# EAGLE design Receiver (EAGLE 5.00)
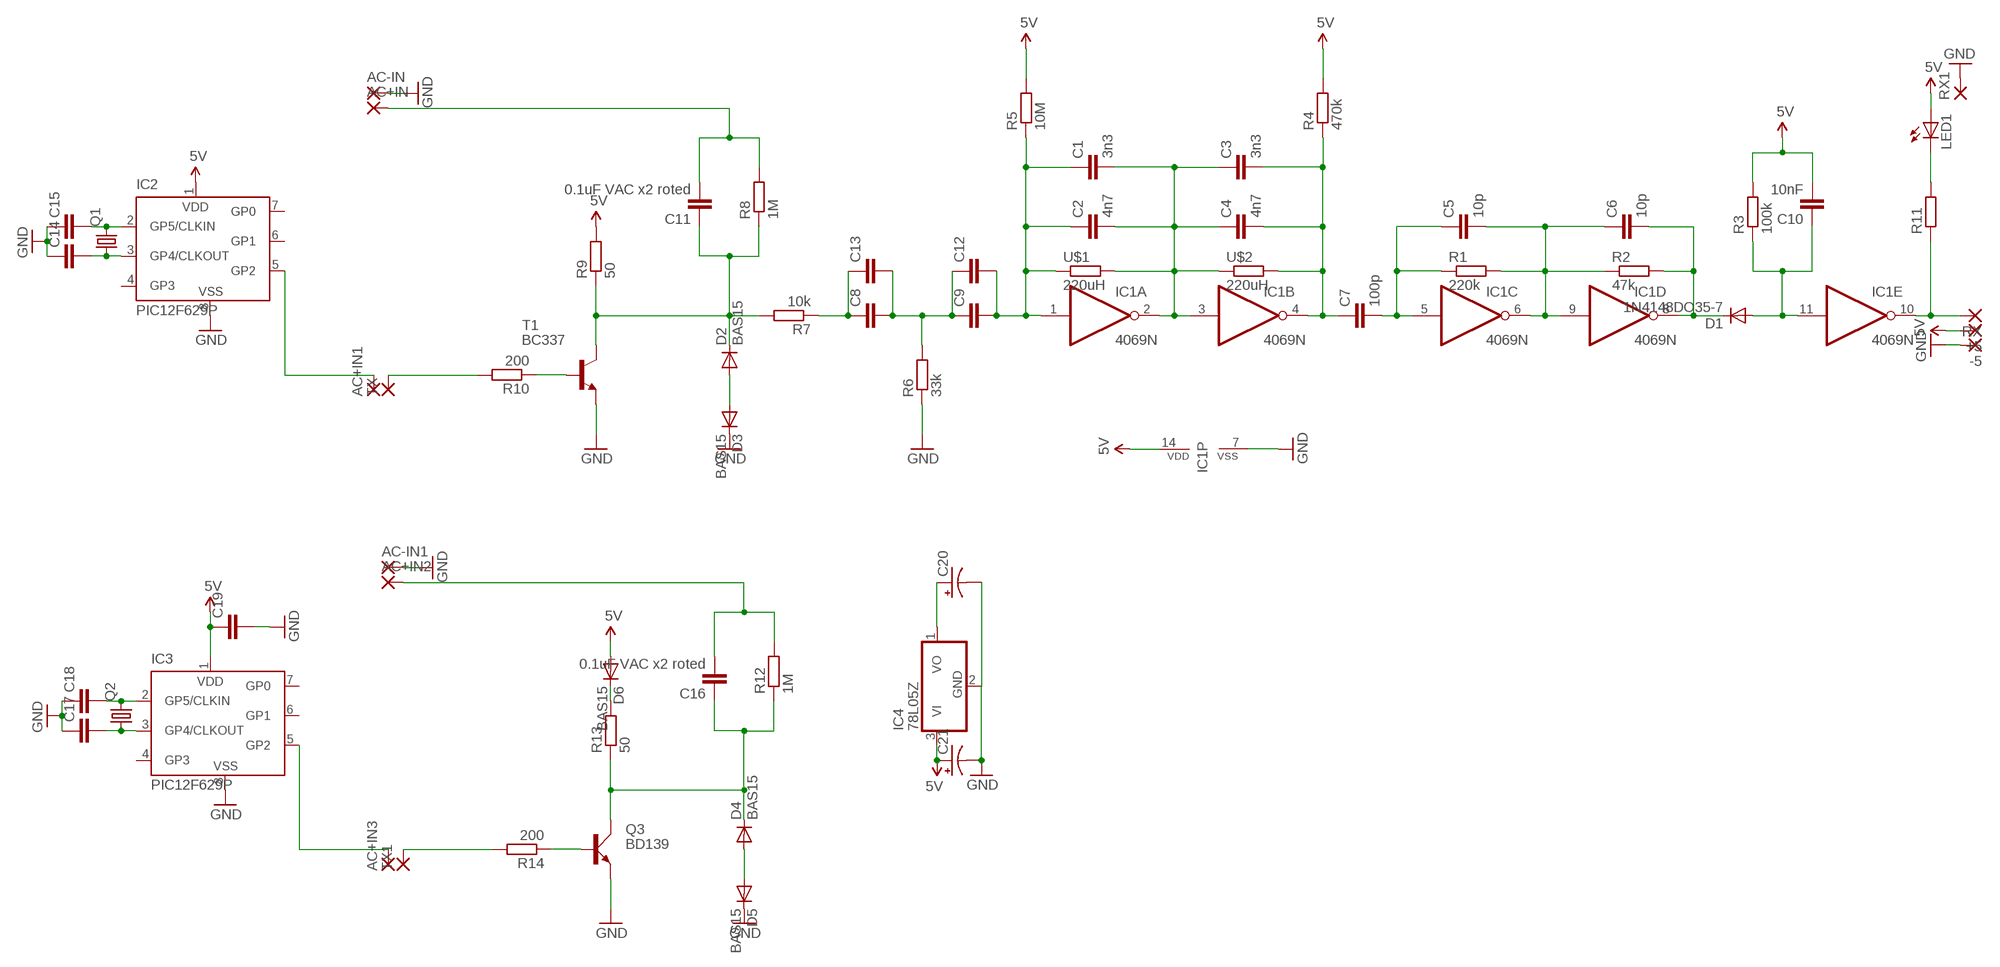
[diagram p0: schematic, sheet 1]

## Parts
+5  2,15/1,0  [2,15/1,0]
-5  2,15/1,0  [2,15/1,0]
AC+IN  2,15/1,0  [2,15/1,0]
AC+IN1  2,15/1,0  [2,15/1,0]
AC+IN2  2,15/1,0  [2,15/1,0]
AC+IN3  2,15/1,0  [2,15/1,0]
AC-IN  2,15/1,0  [2,15/1,0]
AC-IN1  2,15/1,0  [2,15/1,0]
C1  3n3  C2.5/2  [C2.5-2]
C2  4n7  C2.5/2  [C2.5-2]
C3  3n3  C2.5/2  [C2.5-2]
C4  4n7  C2.5/2  [C2.5-2]
C5  10p  C2.5/2  [C2.5-2]
C6  10p  C5/2.5  [C5B2.5]
C7  100p  C2.5/2  [C2.5-2]
C8  C5/3  [C5B3]
C9  C5/3  [C5B3]
C10  10nF  C2.5/2  [C2.5-2]
C11  0.1uF VAC x2 roted  C15/5  [C15B5]
C12  C5/3  [C5B3]
C13  C5/3  [C5B3]
C14  C2.5/2  [C2.5-2]
C15  C2.5/2  [C2.5-2]
C16  0.1uF VAC x2 roted  C15/5  [C15B5]
C17  C2.5/2  [C2.5-2]
C18  C2.5/2  [C2.5-2]
C19  C5/3  [C5B3]
C20  CAP_POLPTH1  [CPOL-RADIAL-100UF-25V]
C21  CAP_POLPTH1  [CPOL-RADIAL-100UF-25V]
D1  1N4148DO35-7  [DO35-7]
D2  BAS15  [DO34-7]
D3  BAS15  [DO34-7]
D4  BAS15  [DO34-7]
D5  BAS15  [DO34-7]
D6  BAS15  [DO34-7]
IC1  4069N  [DIL14]
IC2  PIC12F629P  [DIL8]
IC3  PIC12F629P  [DIL8]
IC4  78L05Z  [TO92]
LED1  LED5MM  [LED5MM]
Q1  CRYSTALHC49S  [HC49/S]
Q2  CRYSTALHC49S  [HC49/S]
Q3  BD139  [TO126AV]
R1  220k  R-EU_0207/2V  [0207/2V]
R2  47k  R-EU_0204/5  [0204/5]
R3  100k  R-EU_0207/2V  [0207/2V]
R4  470k  R-EU_0207/2V  [0207/2V]
R5  10M  R-EU_0204/7  [0204/7]
R6  33k  R-EU_0207/2V  [0207/2V]
R7  10k  R-EU_0207/2V  [0207/2V]
R8  1M  R-EU_0204/7  [0204/7]
R9  50  R-EU_0204/7  [0204/7]
R10  200  R-EU_0204/7  [0204/7]
R11  R-EU_0204/7  [0204/7]
R12  1M  R-EU_0204/7  [0204/7]
R13  50  R-EU_0204/7  [0204/7]
R14  200  R-EU_0204/7  [0204/7]
RX  2,15/1,0  [2,15/1,0]
RX1  2,15/1,0  [2,15/1,0]
T1  BC337  [TO92]
TX  2,15/1,0  [2,15/1,0]
TX1  2,15/1,0  [2,15/1,0]
U$1  220uH  R-EU_0204/5  [0204/5]
U$2  220uH  R-EU_0207/2V  [0207/2V]

## Nets
5V: +5.1(P) C10.2 C19.1 C21.1(+) D6.A IC1.14(P:VDD) IC2.1(VDD) IC3.1(VDD) IC4.3(VI) LED1.A R3.2 R4.2 R5.2 R9.2
GND: -5.1(P) AC-IN1.1(P) AC-IN.1(P) C14.1 C15.1 C17.1 C18.1 C19.2 C20.2(-) C21.2(-) D3.C D5.C IC1.7(P:VSS) IC2.8(VSS) IC3.8(VSS) IC4.2(GND) Q3.E R6.1 RX1.1(P) T1.1(E)
N$1: C5.2 C6.1 IC1.6(C:O) IC1.9(D:I) R1.2 R2.1
N$2: C1.2 C2.2 C3.1 C4.1 IC1.2(A:O) IC1.3(B:I) U$1.2 U$2.1
N$3: C3.2 C4.2 C7.1 IC1.4(B:O) R4.1 U$2.2
N$4: C1.1 C2.1 C9.2 C12.2 IC1.1(A:I) R5.1 U$1.1
N$5: C5.1 C7.2 IC1.5(C:I) R1.1
N$6: C8.2 C9.1 C12.1 C13.2 R6.2
N$7: C6.2 D1.C IC1.8(D:O) R2.2
N$8: C10.1 D1.A IC1.11(E:I) R3.1
N$9: C8.1 C13.1 R7.1
N$10: R10.1 T1.2(B)
N$11: D2.A D3.A
N$12: AC+IN.1(P) C11.2 R8.2
N$13: IC1.10(E:O) R11.1 RX.1(P)
N$14: C11.1 D2.C R7.2 R8.1 R9.1 T1.3(C)
N$15: AC+IN1.1(P) IC2.5(GP2)
N$16: LED1.K(C) R11.2
N$17: R10.2 TX.1(P)
N$18: C15.2 IC2.2(GP5/CLKIN) Q1.2
N$19: C14.2 IC2.3(GP4/CLKOUT) Q1.1
N$20: D4.A D5.A
N$21: AC+IN2.1(P) C16.2 R12.2
N$22: C16.1 D4.C Q3.C R12.1 R13.1
N$23: Q3.B R14.1
N$24: AC+IN3.1(P) IC3.5(GP2)
N$25: R14.2 TX1.1(P)
N$26: C18.2 IC3.2(GP5/CLKIN) Q2.2
N$27: C17.2 IC3.3(GP4/CLKOUT) Q2.1
N$28: D6.C R13.2
N$30: C20.1(+) IC4.1(VO)
Unconnected: IC1.12(F:O) IC1.13(F:I) IC2.4(GP3) IC2.6(GP1) IC2.7(GP0) IC3.4(GP3) IC3.6(GP1) IC3.7(GP0)

## Library data of the parts
+5 -5 AC+IN AC+IN1-AC+IN3 AC-IN AC-IN1 RX RX1 TX TX1 = wirepad:2,15/1,0: THROUGH-HOLE PAD
C1-C19 = capacitor-wima:C: CAPACITOR naming: grid - package width
C20 C21 = SparkFun:CAP_POL: Capacitor Polarized These are standard SMD and PTH capacitors. Normally 10uF, 47uF, and 100uF in electrolytic and tantalum varieties. Always verify the external diameter of the through hole cap, it varies with capacity, voltage, and manufacturer. The EIA devices should be standard.
D1 = diode:1N4148: DIODE high speed (Philips)
D2-D6 = diode:BAS15: DIODE high speed
IC1 = 40xx:4069: Hex INVERTER
IC2 IC3 = microchip:PIC12F6*: Data Sheet 8-Pin FLASH-Based 8-Bit CMOS Microcontrollers Source: http://www.microchip.com .. 41190c.pdf
IC4 = linear:78*: Positive VOLTAGE REGULATOR Source: http://cache.national.com/ds/LM/LM78L05.pdf http://www.fairchildsemi.com/ds/LM/LM7805.pdf
LED1 = SparkFun:LED: LEDs Standard schematic elements and footprints for 5mm, 3mm, 1206, and 0603 sized LEDs. 5mm - Spark Fun Electronics SKU : COM-00529 (and others)
Q1 Q2 = crystal:CRYSTAL: CRYSTAL
Q3 = transistor-power:BD139: NPN TRANSISTOR
R1 R3-R7 U$1 U$2 = resistor:R-EU_: RESISTOR, European symbol
R2 R8-R14 = rcl:R-EU_: RESISTOR, European symbol
T1 = transistor:BC337: NPN TRANSISTOR

## Board
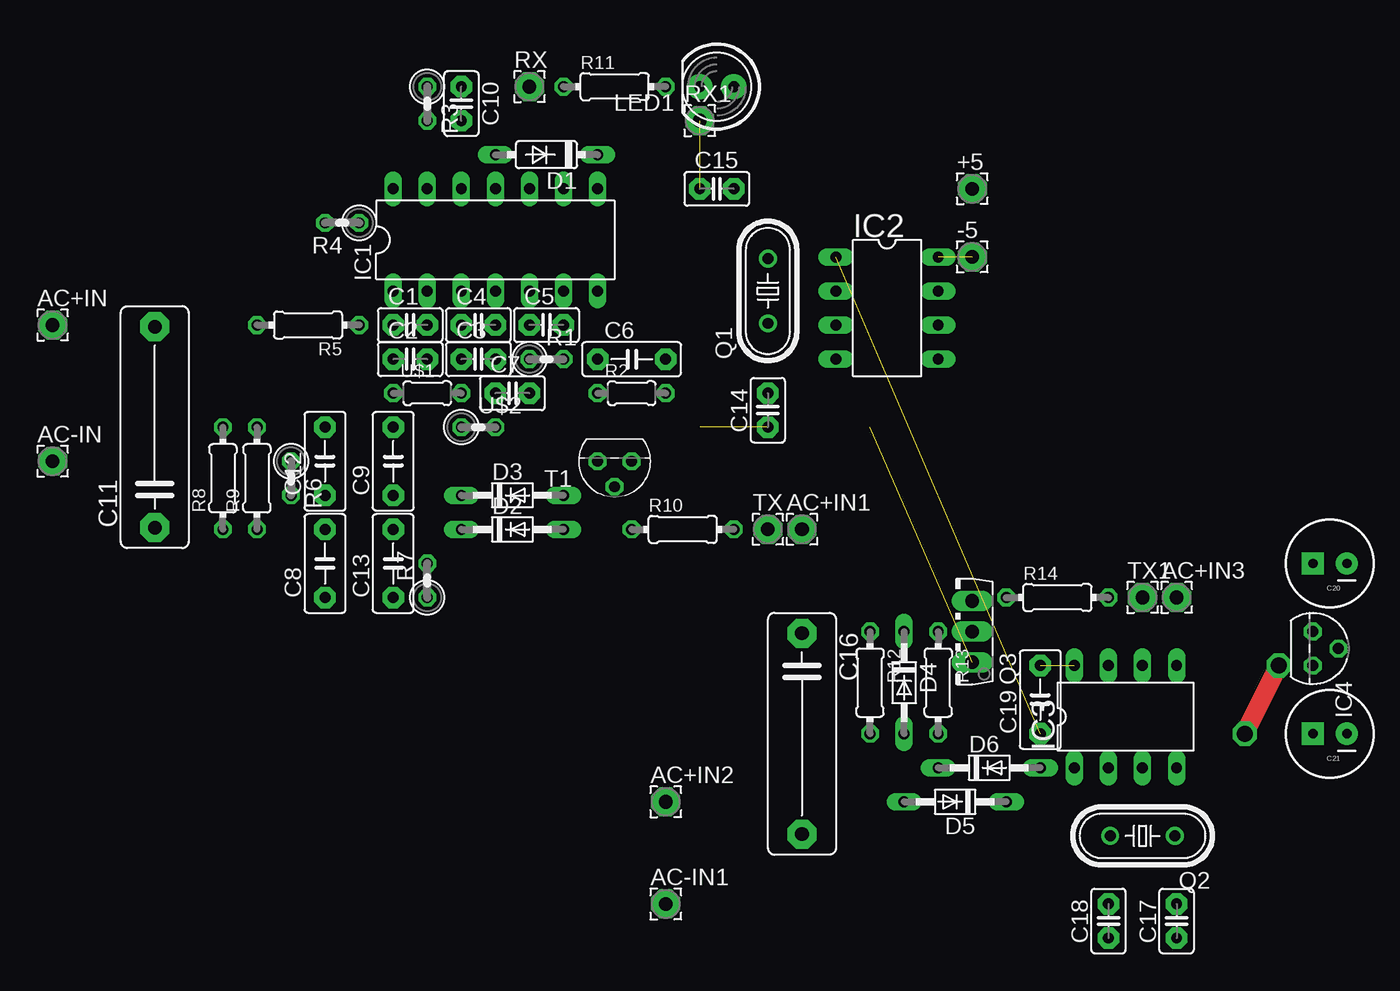
[diagram p1: board, top side]
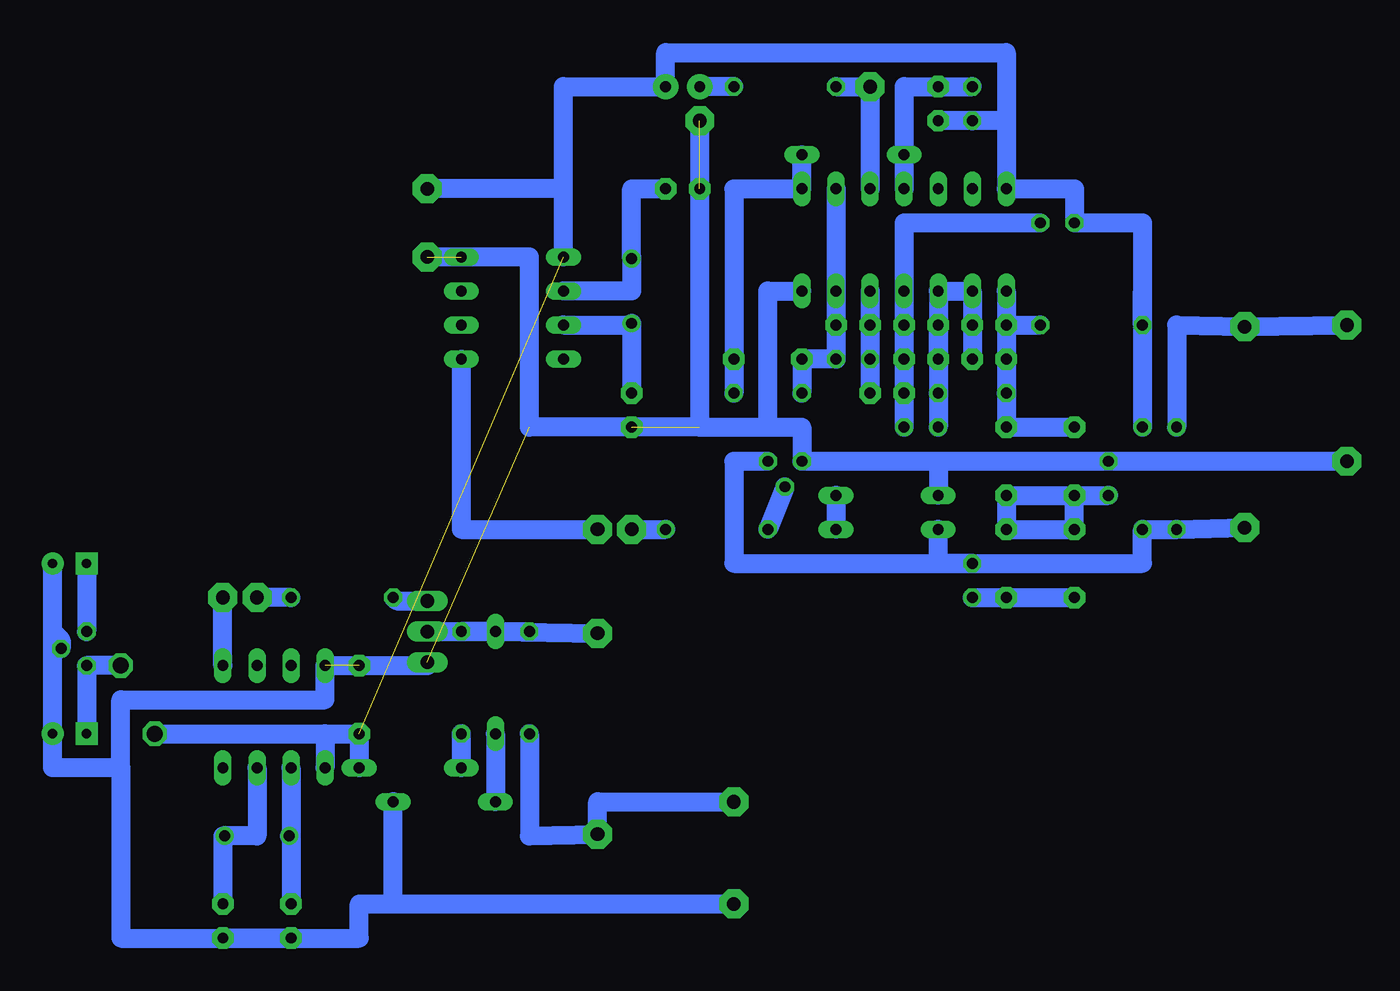
[diagram p2: board, bottom side, seen from below]

No outline drawn. Coordinates in mm, seen from the top.
Copper layers (1*16): Top 0.035mm / dielectric 1.5mm / Bottom 0.035mm
Design rules "default": minimum track width 10mil, minimum drill 24mil, track to track 8mil, track to pad 8mil, pad to pad 8mil, via to via 8mil, smd to smd 8mil, copper to edge 40mil, drill to drill 8mil, minimum pad ring 10mil, minimum via ring 8mil, stop-mask expansion 4mil, vias tented up to drill 0mil, thermal gap 10mil

### Footprints (pad centres in the part's own frame; a part is rotated, then mirrored left to right if it is on the bottom)
2,15/1,0 = drill 1.016 pad 2.159 octagon: 1 0,0
C2.5-2 = drill 0.813 pad 1.6 octagon: 1 -1.27,0; 2 1.27,0
C5B2.5 = drill 0.813 pad 1.6 octagon: 1 -2.54,0; 2 2.54,0
C5B3 = drill 0.813 pad 1.6 octagon: 1 -2.54,0; 2 2.54,0
C15B5 = drill 1.016 pad 2.159 octagon: 1 -7.493,0; 2 7.493,0
CPOL-RADIAL-100UF-25V = drill 0.7 pad 1.651 square: 1 1.27,0 | drill 0.7 pad 1.651 round: 2 -1.27,0
DO35-7 = drill 0.813 long: A 3.81,0; C -3.81,0
DO34-7 = drill 0.813 long: A 3.81,0; C -3.81,0
DIL14 = drill 0.813 long: 1 -7.62,-3.81; 2 -5.08,-3.81; 3 -2.54,-3.81; 4 0,-3.81; 5 2.54,-3.81; 6 5.08,-3.81; 7 7.62,-3.81; 8 7.62,3.81; 9 5.08,3.81; 10 2.54,3.81; 11 0,3.81; 12 -2.54,3.81; 13 -5.08,3.81; 14 -7.62,3.81
DIL8 = drill 0.813 long: 1 -3.81,-3.81; 2 -1.27,-3.81; 3 1.27,-3.81; 4 3.81,-3.81; 5 3.81,3.81; 6 1.27,3.81; 7 -1.27,3.81; 8 -3.81,3.81
TO92 = drill 0.813 octagon: 1 -1.27,0; 2 0,1.905; 3 1.27,0
LED5MM = drill 0.813 pad 1.88 round: A -1.27,0; K 1.27,0
HC49/S = drill 0.813 round: 1 -2.413,0; 2 2.413,0
TO126AV = drill 1.016 long: B 2.286,-1.27; C 0,-1.27; E -2.286,-1.27
0207/2V = drill 0.813 octagon: 1 -1.27,0; 2 1.27,0
0204/5 = drill 0.813 octagon: 1 -2.54,0; 2 2.54,0
0204/7 = drill 0.813 octagon: 1 -3.81,0; 2 3.81,0
TO92' = drill 0.813 octagon: 1 1.27,0; 2 0,1.905; 3 -1.27,0

### Placement (x,y rotation side)
+5  35.56,-15.24 0 top
-5  35.56,-20.32 0 top
AC+IN  -33.02,-25.4 0 top
AC+IN1  22.86,-40.64 0 top
AC+IN2  12.7,-60.96 0 top
AC+IN3  50.8,-45.72 0 top
AC-IN  -33.02,-35.56 0 top
AC-IN1  12.7,-68.58 0 top
C1  -6.35,-25.4 0 top
C2  -6.35,-27.94 0 top
C3  -1.27,-27.94 0 top
C4  -1.27,-25.4 0 top
C5  3.81,-25.4 0 top
C6  10.16,-27.94 0 top
C7  1.27,-30.48 0 top
C8  -12.7,-43.18 90 top
C9  -7.62,-35.56 90 top
C10  -2.54,-8.89 270 top
C11  -25.4,-33.02 90 top
C12  -12.7,-35.56 90 top
C13  -7.62,-43.18 90 top
C14  20.32,-31.75 90 top
C15  16.51,-15.24 0 top
C16  22.86,-55.88 270 top
C17  50.8,-69.85 90 top
C18  45.72,-69.85 90 top
C19  40.64,-53.34 90 top
C20  62.23,-43.18 180 top
C21  62.23,-55.88 180 top
D1  3.81,-12.7 180 top
D2  1.27,-40.64 0 top
D3  1.27,-38.1 0 top
D4  30.48,-52.07 270 top
D5  34.29,-60.96 180 top
D6  36.83,-58.42 0 top
IC1  0,-19.05 0 top
IC2  29.21,-24.13 270 top
IC3  46.99,-54.61 0 top
IC4  60.96,-49.53 270 top
LED1  16.51,-7.62 180 top
Q1  20.32,-22.86 90 top
Q2  48.26,-63.5 180 top
Q3  34.29,-48.26 90 top
R1  3.81,-27.94 0 top
R2  10.16,-30.48 0 top
R3  -5.08,-8.89 270 top
R4  -11.43,-17.78 180 top
R5  -13.97,-25.4 180 top
R6  -15.24,-36.83 270 top
R7  -5.08,-44.45 90 top
R8  -20.32,-36.83 90 top
R9  -17.78,-36.83 90 top
R10  13.97,-40.64 0 top
R11  8.89,-7.62 0 top
R12  27.94,-52.07 270 top
R13  33.02,-52.07 270 top
R14  41.91,-45.72 0 top
RX  2.54,-7.62 0 top
RX1  15.24,-10.16 0 top
T1  BC337  [TO92']  8.89,-35.56 180 top
TX  20.32,-40.64 0 top
TX1  48.26,-45.72 0 top
U$1  -5.08,-30.48 0 top
U$2  -1.27,-33.02 0 top

### Tracks (layer width: path | path; a pad name or v marks a point on that pad's centre or on a via)
5V  (via drill 1.2)  (1 unrouted)
  Top 1.422: v55.88,-55.88 v58.42,-50.8
  Bottom 1.422: R3.2 C10.2 R3.2 | R5.2 -17.78,-17.78 R4.2 -12.7,-15.24 IC1.14 -7.62,-10.16 | +5.1 25.4,-15.24 IC2.1 25.4,-7.62 LED1.A 17.78,-5.08 -7.62,-5.08 -7.62,-10.16 | R5.2 -17.78,-22.86 | R5.2 R9.2 | -7.62,-10.16 R3.2 | 43.18,-55.88 C19.1 D6.A | 43.18,-55.88 IC3.1 | v55.88,-55.88 43.18,-55.88 | C21.1 IC4.3 v58.42,-50.8
GND  (5 unrouted)
  Bottom 1.422: -2.54,-35.56 D3.C | -2.54,-35.56 R6.1 AC-IN.1 | -2.54,-35.56 T1.1 7.62,-33.02 10.16,-33.02 | 15.24,-33.02 27.94,-33.02 27.94,-20.32 -5.1 | 15.24,-33.02 10.16,-33.02 | IC1.7 10.16,-22.86 10.16,-33.02 | RX1.1 15.24,-33.02 | C18.1 C17.1 | C18.1 58.42,-71.12 58.42,-58.42 | 58.42,-58.42 58.42,-53.34 43.18,-53.34 IC3.8 35.56,-50.8 Q3.E | C18.1 40.64,-71.12 40.64,-68.58 | 40.64,-68.58 38.1,-68.58 D5.C | 40.64,-68.58 AC-IN1.1 | 63.5,-48.26 C21.2 63.5,-58.42 58.42,-58.42 | 63.5,-48.26 C20.2 | IC4.2 62.87,-48.9 63.5,-48.26
N$1
  Bottom 1.422: C6.1 R1.2 C5.2 IC1.6 IC1.9 | C6.1 R2.1 C6.1
N$2
  Bottom 1.422: C2.2 C1.2 IC1.2 IC1.3 C3.1 | C3.1 C4.1 | C3.1 U$1.2 U$2.1
N$3
  Bottom 1.422: U$2.2 C7.1 C3.2 C4.2 IC1.4 0,-17.78 R4.1
N$4
  Bottom 1.422: C1.1 R5.1 | C1.1 C2.1 U$1.1 C9.2 C12.2 | IC1.1 C1.1
N$5
  Bottom 1.422: IC1.5 C5.1 R1.1 C7.2
N$6
  Bottom 1.422: C12.1 C8.2 C13.2 C9.1 R6.2
N$7
  Bottom 1.422: D1.C IC1.8 12.7,-15.24 C6.2 R2.2
N$8
  Bottom 1.422: R3.1 C10.1 0,-7.62 D1.A IC1.11
N$9
  Bottom 1.422: C8.1 C13.1 R7.1
N$10
  Bottom 1.422: T1.2 R10.1
N$11
  Bottom 1.422: D3.A D2.A
N$12
  Bottom 1.422: AC+IN.1 C11.2 -20.32,-25.4 R8.2
N$13
  Bottom 1.422: IC1.10 RX.1 R11.1
N$14
  Bottom 1.422: C11.1 R8.1 R9.1 -17.78,-43.18 R7.2 | D2.C -2.54,-43.18 R7.2 | R7.2 12.7,-43.18 12.7,-35.56 T1.3
N$15
  Bottom 1.422: AC+IN1.1 33.02,-40.64 IC2.5
N$16
  Bottom 1.422: R11.2 LED1.K
N$17
  Bottom 1.422: TX.1 R10.2
N$18
  Bottom 1.422: C15.2 20.32,-15.24 20.32,-20.32 | Q1.2 20.32,-20.32 | IC2.2 20.32,-22.86 20.32,-20.32
N$19
  Bottom 1.422: 20.32,-25.4 C14.2 | 20.32,-25.4 Q1.1 | IC2.3 20.32,-25.4
N$20
  Bottom 1.422: D4.A D5.A
N$21
  Bottom 1.422: AC+IN2.1 22.86,-60.96 C16.2 27.94,-63.5 R12.2
N$22
  Bottom 1.422: D4.C R12.1 | D4.C C16.1 | D4.C R13.1 | Q3.C D4.C
N$23
  Bottom 1.422: Q3.B 37.85,-45.97 R14.1
N$24
  Bottom 1.422: IC3.5 AC+IN3.1
N$25
  Bottom 1.422: R14.2 TX1.1
N$26
  Bottom 1.422: IC3.2 45.72,-63.5 | 45.72,-63.5 Q2.2 | 45.72,-63.5 C18.2
N$27
  Bottom 1.422: IC3.3 48.26,-63.5 Q2.1 50.8,-63.5 C17.2
N$28
  Bottom 1.422: R13.2 D6.C
N$30
  Bottom 1.422: C20.1 IC4.1